# Altium schematic sheet Sheet1.SchDoc
size A2; SheetNumber: 1; SheetTotal: 1; LCSC: C3019055
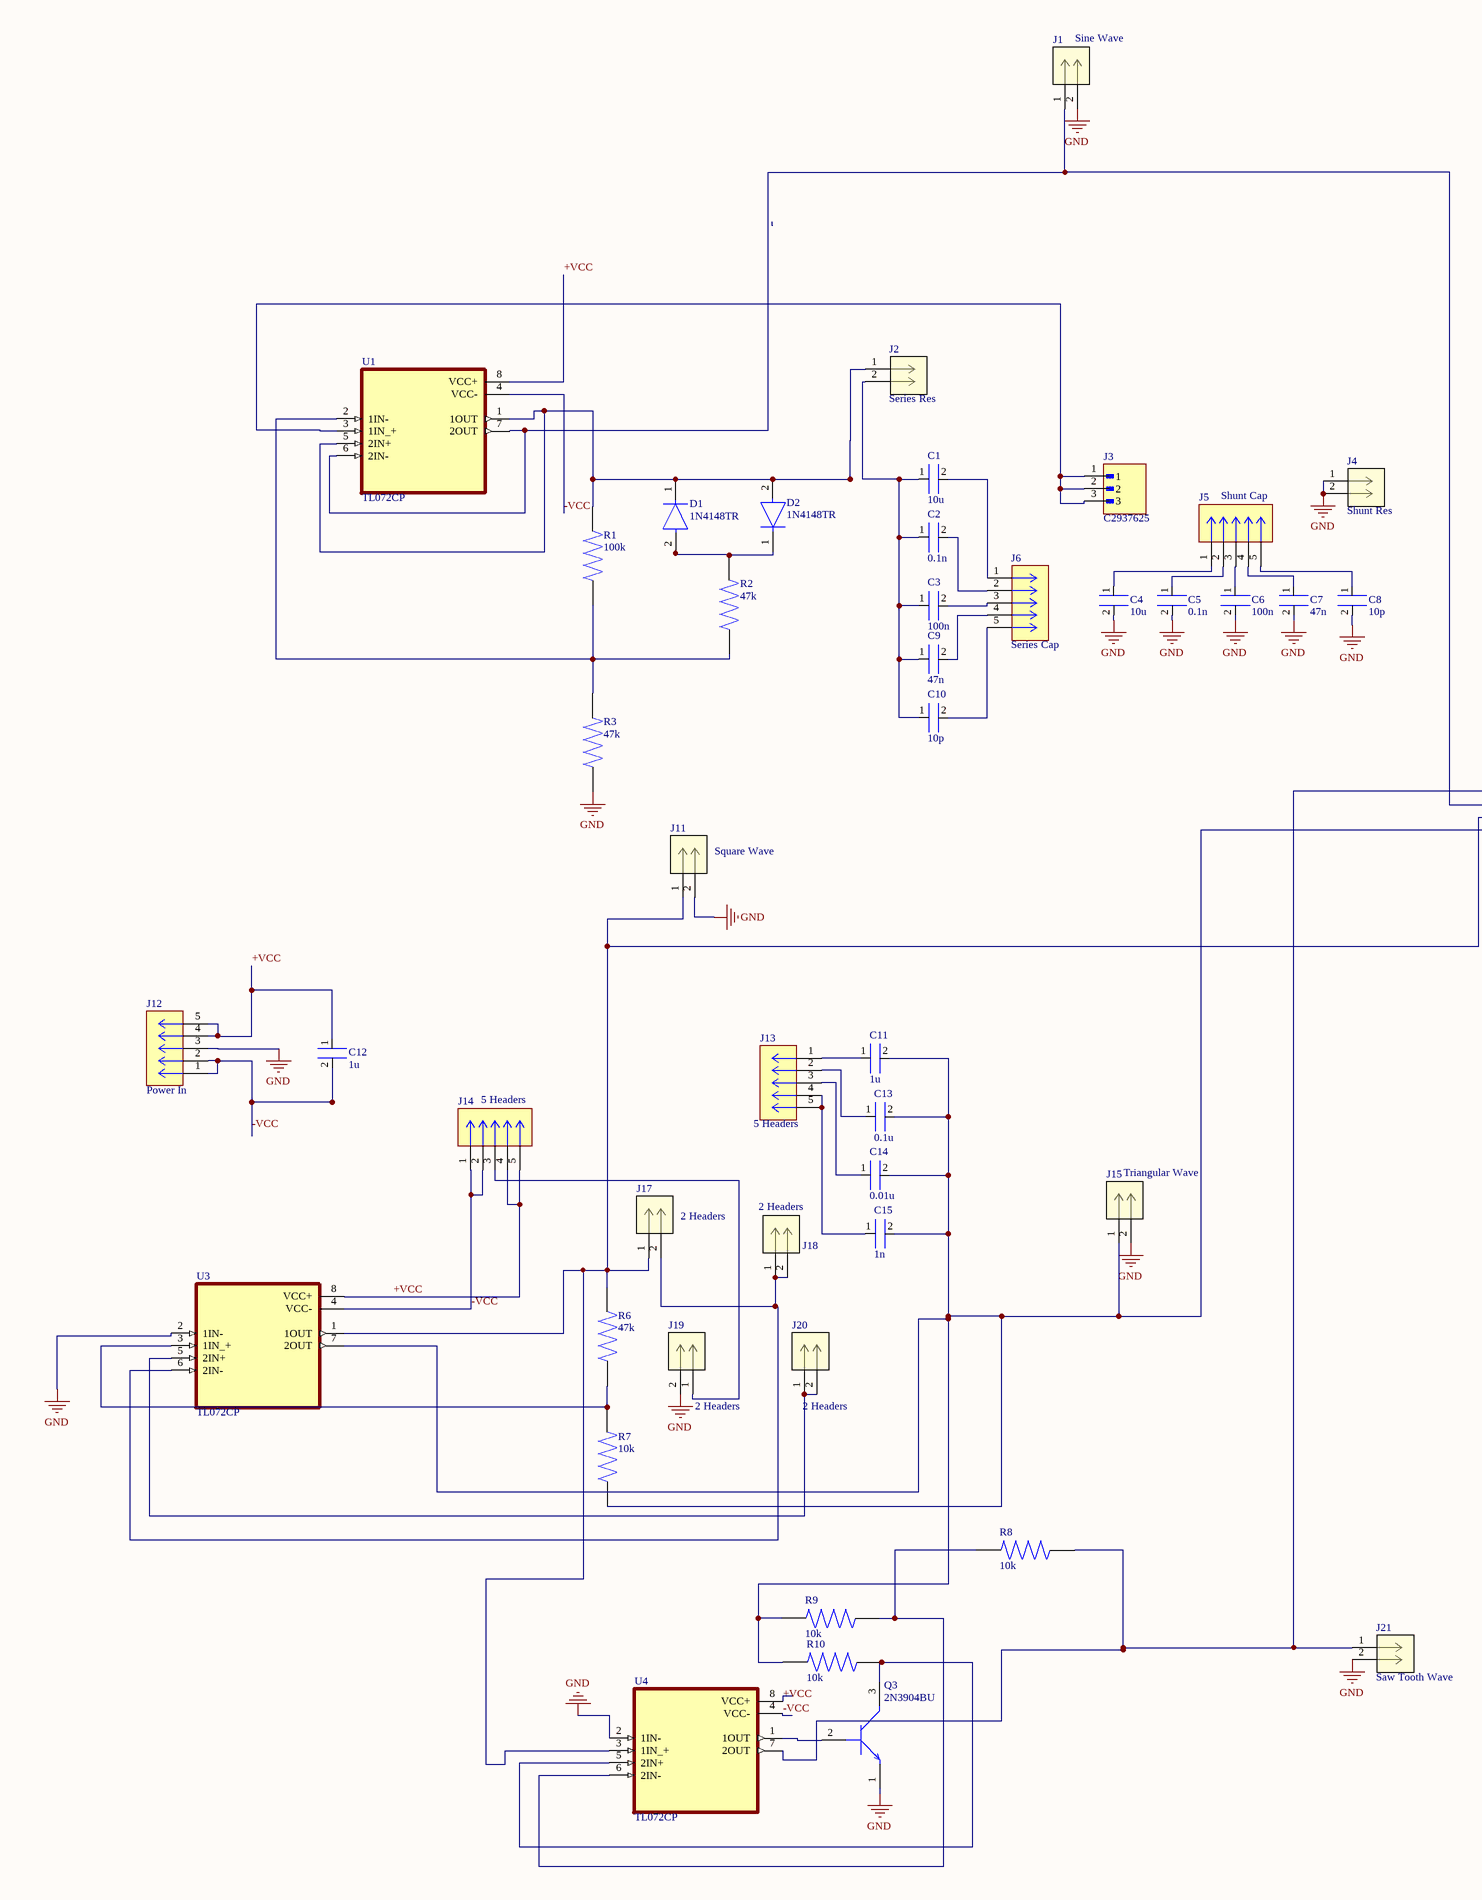
[diagram p0: Sheet1.SchDoc, left]
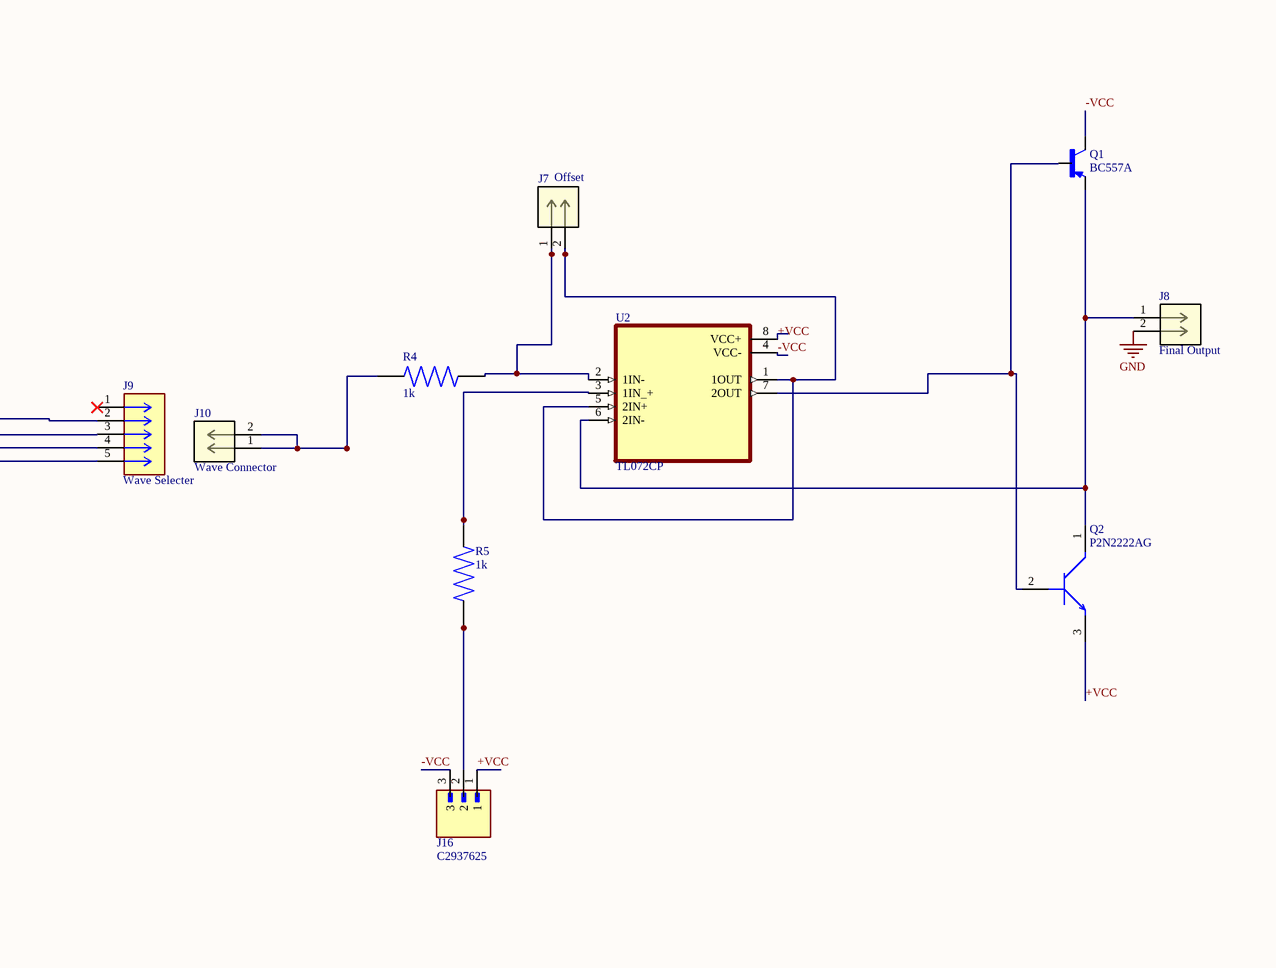
[diagram p1: Sheet1.SchDoc, right]

## Parts
C1  10u  [CAPACITORS]
C2  0.1n  [CAPACITORS]
C3  100n  [CAPACITORS]
C4  10u  [CAPACITORS]
C5  0.1n  [CAPACITORS]
C6  100n  [CAPACITORS]
C7  47n  [CAPACITORS]
C8  10p  [CAPACITORS]
C9  47n  [CAPACITORS]
C10  10p  [CAPACITORS]
C11  1u  [CAPACITORS]
C12  1u  [CAPACITORS]
C13  0.1u  [CAPACITORS]
C14  0.01u  [CAPACITORS]
C15  1n  [CAPACITORS]
D1  1N4148TR  [FP-017AG-MFG]
D2  1N4148TR  [FP-017AG-MFG]
J1  Sine Wave  [02PIN HEADERS]
J2  Series Res  [02PIN HEADERS]
J3  C2937625  [03PIN HEADERS]
J4  Shunt Res  [02PIN HEADERS]
J5  Shunt Cap  [05pin Headers]
J6  Series Cap  [05pin Headers]
J7  Offset  [02PIN HEADERS]
J8  Final Output  [02PIN HEADERS]
J9  Wave Selecter  [05pin Headers]
J10  Wave Connector  [02PIN HEADERS]
J11  Square Wave  [02PIN HEADERS]
J12  Power In  [05pin Headers]
J13  5 Headers  [05pin Headers]
J14  5 Headers  [05pin Headers]
J15  Triangular Wave  [02PIN HEADERS]
J16  C2937625  [03PIN HEADERS]
J17  2 Headers  [02PIN HEADERS]
J18  2 Headers  [02PIN HEADERS]
J19  2 Headers  [02PIN HEADERS]
J20  2 Headers  [02PIN HEADERS]
J21  Saw Tooth Wave  [02PIN HEADERS]
Q1  BC557A  [TO92254P460H750-3]
Q2  P2N2222AG  [TO92254P460H750-3]
Q3  2N3904BU  [TO92254P460H750-3]
R1  100k  [Resistor]
R2  47k  [Resistor]
R3  47k  [Resistor]
R4  1k  [Resistor]
R5  1k  [Resistor]
R6  47k  [Resistor]
R7  10k  [Resistor]
R8  10k  [Resistor]
R9  10k  [Resistor]
R10  10k  [Resistor]
U1  TL072CP  [TL072CP]
U2  TL072CP  [TL072CP]
U3  TL072CP  [TL072CP]
U4  TL072CP  [TL072CP]

## Nets
GND: C4.2 C5.2 C6.2 C7.2 C8.2 J1.2 J4.1 J4.2 J8.2 J11.2 J12.3 J15.2 J19.2 J21.2 Q3.1 R3.1 U3.2(1IN-) U4.2(1IN-)
+VCC: C12.1 J12.4 J12.5 J14.4 J14.5 J16.1 Q2.3 U1.8(VCC+) U2.8(VCC+) U3.8(VCC+) U4.8(VCC+)
-VCC: C12.2 J12.1 J12.2 J14.1 J14.2 J16.3 Q1.1(C) U1.4(VCC-) U2.4(VCC-) U3.4(VCC-) U4.4(VCC-)
NetC1_1: C1.1 C2.1 C3.1 C9.1 C10.1 J2.2
NetC1_2: C1.2 J6.1
NetC2_2: C2.2 J6.2
NetC3_2: C3.2 J6.3
NetC4_1: C4.1 J5.1
NetC5_1: C5.1 J5.2
NetC6_1: C6.1 J5.3
NetC7_1: C7.1 J5.4
NetC8_1: C8.1 J5.5
NetC9_2: C9.2 J6.4
NetC10_2: C10.2 J6.5
NetC11_1: C11.1 J13.1
NetC11_2: C11.2 C13.2 C14.2 C15.2 J9.5 J15.1 R7.1 R9.2 R10.2 U3.7(2OUT)
NetC13_1: C13.1 J13.2
NetC14_1: C14.1 J13.3
NetC15_1: C15.1 J13.4 J13.5
NetD1_1: D1.1(C) D2.2(A) J2.1 R1.2 U1.1(1OUT) U1.5(2IN+)
NetD1_2: D1.2(A) D2.1(C) R2.2
NetJ1_1: J1.1 J9.3 U1.6(2IN-)
NetJ3_1: J3.1 J3.2 J3.3 U1.3(1IN_+)
NetJ7_1: J7.1 R4.2 U2.2(1IN-)
NetJ7_2: J7.2 U2.1(1OUT) U2.5(2IN+)
NetJ8_1: J8.1 Q1.3(E) Q2.1 U2.6(2IN-)
NetJ9_2: J9.2 J21.1 R8.1 U4.7(2OUT)
NetJ9_4: J9.4 J11.1 J17.1 R6.2 U3.1(1OUT) U4.3(1IN_+)
NetJ10_1: J10.1 J10.2 R4.1
NetJ14_3: J14.3 J19.1
NetJ16_2: J16.2 R5.2
NetJ17_2: J17.2 J18.1 J18.2 U3.6(2IN-)
NetJ20_1: J20.1 J20.2 U3.5(2IN+)
NetQ1_2: Q1.2(B) Q2.2 U2.7(2OUT)
NetQ3_2: Q3.2 U4.1(1OUT)
NetQ3_3: Q3.3 R10.1 U4.5(2IN+)
NetR1_1: R1.1 R2.1 R3.2 U1.2(1IN-)
NetR5_1: R5.1 U2.3(1IN_+)
NetR6_1: R6.1 R7.2 U3.3(1IN_+)
NetR8_2: R8.2 R9.1 U4.6(2IN-)

Not connected (* = marked no-connect by the designer): J9 1*; U1 7(2OUT)

## Library data of the parts
C1 C4 = CC1206JRNPO9BN100: 400V10uF CD110; LCSC: C2960249
C2 C5 = CC1206JRNPO9BN100: USR1H0R1MDD; LCSC: C5112145
C3 C6 C15 = CC1206JRNPO9BN100: CK45-B3DD102KYNNA; LCSC: C97722
C7 C9 = CC1206JRNPO9BN100: KP473J2J0702; LCSC: C390077
C8 C10 = CC1206JRNPO9BN100: CC45SL3FD100JYNNA; LCSC: C694205
C11 = CC1206JRNPO9BN100: PE105J2A0502; LCSC: C390070
C12 = CC1206JRNPO9BN100: CC1206KKX7R7BB105; LCSC: C106236
C13 = CC1206JRNPO9BN100: MPP104J2G10NN22640; LCSC: C506840
C14 = CC1206JRNPO9BN100: KP103J2G0501; LCSC: C3019055
D1 D2 = CMP-07163-000030-1: DIODE GEN PURP 100V 200MA DO35; Manufacturer: ON Semiconductor; Peak Reverse Current: 5uA; Value: 4pF; Max Junction Temp: +175°C; Max Surge Forward Current: 1A; Footprint Url: https://www.onsemi.com/pub/Collateral/017AG.PDF; Temperature Range Low: -55°C; Max Repetitive Reverse Voltage: 100V; Temperature Range High: +175°C; Reverse Voltage: 100V; ComponentLink2URL: https://www.onsemi.com/pub/Collateral/1N914A-D.pdf; Category: Diode; Package: 017AG; Octopart: https://octopart.com/1n4148tr-on+semiconductor-84323125; Device Class L1: Discrete Semiconductors; Manufacturer Part Number: 1N4148TR; Forward Current: 200mA; Temperature: -55°C to +175°C; Lead Free: Yes; Digikey Description: DIODE GEN PURP 100V 200MA DO35; Mouser Description: 1N4148 Series 100 V 500 mW Small Signal Fast Switching Diode - DO-35; Automotive: No; Device Class L2: Diodes; Device Class L3: Rectifier Diodes; Height: 1.91mm; ComponentLink2Description: Datasheet; RoHS: TRUE; Capacitance: 4pF; LCSC: C84410
J1 J2 J4 J7 J8 J10 J11 J15 J17-J21 = 22284025: KK 254 Breakaway Header, Vertical, 2 Circuits, 0.38Âµm Gold (Au) Selective Plating, Mating Pin Length 7.49mm; Manufacturer_Name: Molex Connector Corporation; Copyright: Copyright (C) 2025 Ultra Librarian. All rights reserved.; Manufacturer_Part_Number: 22284025; RefDes: RefDes; Type: Type; LCSC: C6025575
J3 J16 = 61300311121: Package: None; Price: None; MP: 61300311121; Availability: Unavailable; LCSC: C2937625
J5 J6 J9 J12-J14 = 22284055: Package: None; Price: None; Value: *; MP: 22284055; Availability: Unavailable; LCSC: C6956150
Q1 = BC557A: BC557ATA; MF: Diotec Semiconductor; SnapEDA_Link: https://www.snapeda.com/parts/BC557A/Diotec/view-part/?ref=snap; Package: TO-92 Diotec; Value: *; MP: BC557A; Check_prices: https://www.snapeda.com/parts/BC557A/Diotec/view-part/?ref=eda; LCSC: C900807
R1 = RT1206WRD07100KL: Package: None; Price: None; MP: RT1206WRD07100KL; Availability: Unavailable; LCSC: C1365491
R2 R3 R6 = RT1206WRD0747KL: LCSC: C1365518
R4 R5 = RT1206WRD0710KL: ROX1SJ1K0; LCSC: C1368147
R7-R10 = RT1206WRD0710KL: LCSC: C1368139
U1-U4 = TL072CP: LCSC: C7236